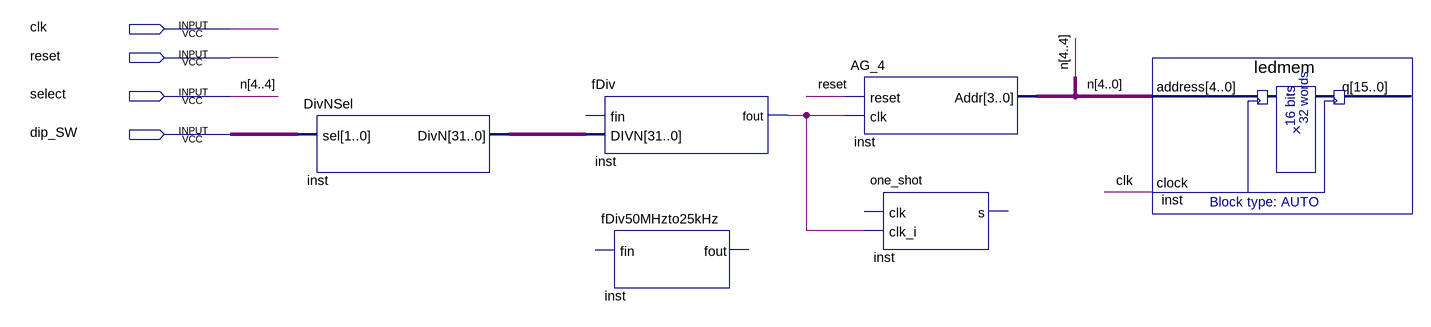
[diagram p0: schematic sheet]
// Quartus schematic w4.bdf as structural Verilog: 6 symbols, 4 pins
module w4 (
  input  clk,
  input  reset,
  input  select,
  input  dip_SW
);

  wire inst_fout;
  wire [1:0] undriven;
  wire [3:0] n;
  wire [31:0] inst_divn;

  DivNSel inst (.sel(undriven), .DivN(inst_divn));
  fDiv inst_dup2 (.DIVN(inst_divn), .fout(inst_fout));  // open: fin
  fDiv50MHzto25kHz inst_dup3 ();  // open: fin, fout
  AG_4 inst_dup4 (.reset(reset), .clk(inst_fout), .Addr({select, n}));
  one_shot inst_dup5 (.clk_i(inst_fout));  // open: clk, s
  ledmem inst_dup6 (.address({select, n}), .clock(clk));  // open: q

  // Other names for the same wires on the sheet: n[4] = select
endmodule
